# EasyEDA schematic SCH_Satlla_4_Main_Board_2023-01-26.json
TITLE: Main_Board_SATLLA_2.1; REV: 1.0; Date: 2021-02-11; Sheet: 1/1; Drawn By: KCG LAB; Company: KCG_LAB
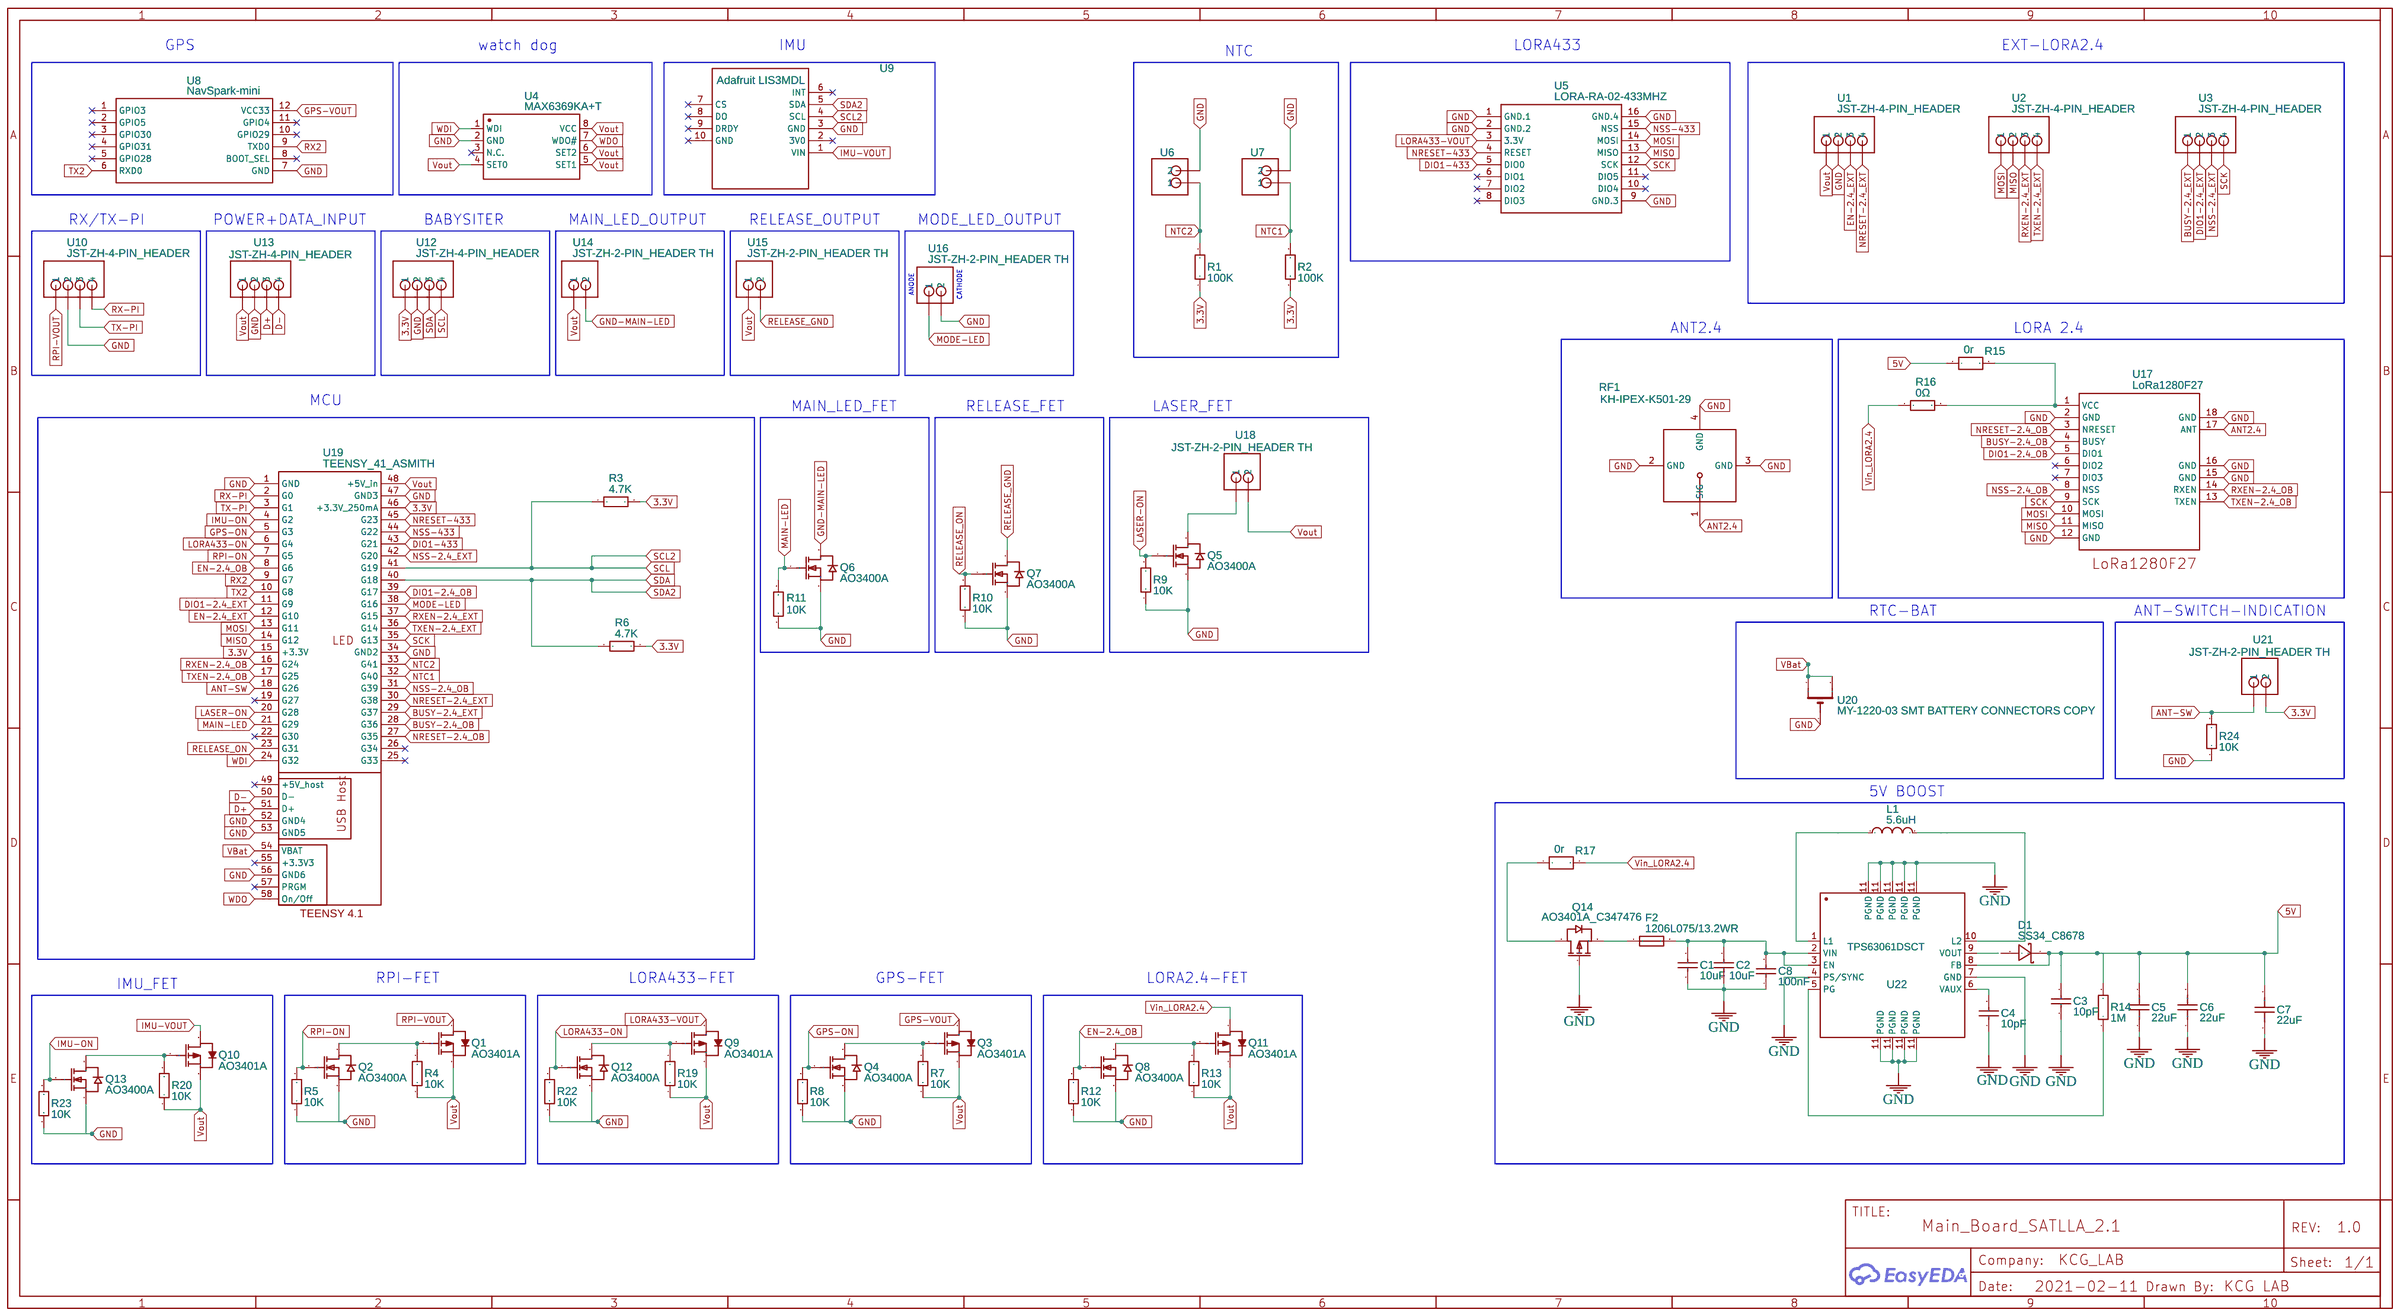
[diagram p0: schematic sheet]

## Parts
C1  10uF  [C0603]
C2  10uF  [C0603]
C3  10pF  [C0603]
C4  10pF  [C0603]
C5  22uF  [C0805]
C6  22uF  [C0805]
C7  22uF  [C0805]
C8  100nF  [C0603]
D1  SS34_C8678  [DO-214AC_L4.3-W2.7-LS5.3-RD]
F2  1206L075/13.2WR  [F1206]
L1  5.6uH  [IND-SMD_L5.4-W5.2]
Q1  AO3401A  [SOT-23_L2.9-W1.3-P1.90-LS2.4-BR]
Q2  AO3400A  [SOT-23-3_L2.9-W1.6-P1.90-LS2.8-BR]
Q3  AO3401A  [SOT-23_L2.9-W1.3-P1.90-LS2.4-BR]
Q4  AO3400A  [SOT-23-3_L2.9-W1.6-P1.90-LS2.8-BR]
Q5  AO3400A  [SOT-23-3_L2.9-W1.6-P1.90-LS2.8-BR]
Q6  AO3400A  [SOT-23-3_L2.9-W1.6-P1.90-LS2.8-BR]
Q7  AO3400A  [SOT-23-3_L2.9-W1.6-P1.90-LS2.8-BR]
Q8  AO3400A  [SOT-23-3_L2.9-W1.6-P1.90-LS2.8-BR]
Q9  AO3401A  [SOT-23_L2.9-W1.3-P1.90-LS2.4-BR]
Q10  AO3401A  [SOT-23_L2.9-W1.3-P1.90-LS2.4-BR]
Q11  AO3401A  [SOT-23_L2.9-W1.3-P1.90-LS2.4-BR]
Q12  AO3400A  [SOT-23-3_L2.9-W1.6-P1.90-LS2.8-BR]
Q13  AO3400A  [SOT-23-3_L2.9-W1.6-P1.90-LS2.8-BR]
Q14  AO3401A_C347476  [SOT-23_L2.9-W1.3-P1.90-LS2.4-BR]
R1  100K  [R0603]
R2  100K  [R0603]
R3  4.7K  [R0603]
R4  10K  [R0603]
R5  10K  [R0603]
R6  4.7K  [R0603]
R7  10K  [R0603]
R8  10K  [R0603]
R9  10K  [R0603]
R10  10K  [R0603]
R11  10K  [R0603]
R12  10K  [R0603]
R13  10K  [R0603]
R14  1M  [R0603]
R15  0r  [R0603]
R16  0Ω  [R0603]
R17  0r  [R0603]
R19  10K  [R0603]
R20  10K  [R0603]
R22  10K  [R0603]
R23  10K  [R0603]
R24  10K  [R0603]
RF1  KH-IPEX-K501-29  [ANT-SMD_KH-IPEX-K501-29]
U1  JST-ZH-4-PIN_HEADER  [JST-ZH-4 1.5MM]
U2  JST-ZH-4-PIN_HEADER  [JST-ZH-4 1.5MM]
U3  JST-ZH-4-PIN_HEADER  [JST-ZH-4 1.5MM]
U4  MAX6369KA+T  [SOT-23-8_L3.0-W1.7-P0.65-LS2.8-TL]
U5  LORA-RA-02-433MHZ  [LORA-RA2-SMD]
U6  JST-ZH-2-PIN_HEADER TH  [JST-ZH-2 1.5MM TH]
U7  JST-ZH-2-PIN_HEADER TH  [JST-ZH-2 1.5MM TH]
U8  NavSpark-mini  [NAVSPARK-MINI]
U9  Adafruit LIS3MDL  [9 DOF IMU_SATLLA_3]
U10  JST-ZH-4-PIN_HEADER  [JST-ZH-4 1.5MM]
U12  JST-ZH-4-PIN_HEADER  [JST-ZH-4 1.5MM]
U13  JST-ZH-4-PIN_HEADER  [JST-ZH-4 1.5MM]
U14  JST-ZH-2-PIN_HEADER TH  [JST-ZH-2 1.5MM TH]
U15  JST-ZH-2-PIN_HEADER TH  [JST-ZH-2 1.5MM TH]
U16  JST-ZH-2-PIN_HEADER TH  [JST-ZH-2 1.5MM TH]
U17  LoRa1280F27  [LORA1280F27]
U18  JST-ZH-2-PIN_HEADER TH  [JST-ZH-2 1.5MM TH]
U19  TEENSY_41_ASMITH  [TEENSY-4.1-ALL-PINS-ASMITH]
U20  MY-1220-03 SMT BATTERY CONNECTORS COPY  [MY-1220-03 SMT COPY]
U21  JST-ZH-2-PIN_HEADER TH  [JST-ZH-2 1.5MM TH]
U22  TPS63061DSCT  [WSON-10_L3.0-W3.0-P0.50-BL-EP]

## Library data of the parts
C1 C2 = GRM188R61C106MA73D: Supplier: LCSC; Manufacturer: MuRata; Contributor: LCSC; Supplier Part: C86277
C3 C4 = 0603CG100J101NT: Supplier: LCSC; Manufacturer: FH; Supplier Part: C56033; JLCPCB Part Class: Extended Part
C5-C7 = GRM219R61C226ME15L: Supplier: LCSC; Supplier Part: C162295; Manufacturer: Murata Electronics; Contributor: LCSC
C8 = 0603F104M500NT: Supplier: LCSC; Manufacturer: FH; Supplier Part: C42998; JLCPCB Part Class: Extended Part
D1 = SS34_C8678: Supplier: LCSC; Manufacturer Part: SS34; Manufacturer: MDD; Supplier Part: C8678; JLCPCB Part Class: Basic Part
F2 = 1206L075/13.2WR: Supplier: LCSC; Supplier Part: C207036; Manufacturer: Littelfuse; Contributor: LCSC
L1 = YSPI0530-5R6M: Supplier: LCSC; Supplier Part: C497860; Manufacturer: YJYCOIN; Contributor: LCSC
Q1 Q3 Q9-Q11 = AO3401A: Supplier: LCSC; Manufacturer: AOS; Supplier Part: C15127; JLCPCB Part Class: Basic Part; Package Display: No
Q2 Q4-Q8 Q12 Q13 = AO3400A: Supplier: LCSC; Manufacturer: AOS; image: //image.lceda.cn/szlcsc/C20917.jpg; Supplier Part: C20917; SMT Type: Basic; JLCPCB SMD: Yes; LCSC Assembly: Yes
Q14 = AO3401A_C347476: Supplier: LCSC; Supplier Part: C347476; Manufacturer: Youtai Semiconductor Co., Ltd.; Manufacturer Part: AO3401A; Contributor: LCSC; JLCPCB Part Class: Extended Part
R1 R2 = RC0603JR-07100KL: Supplier: LCSC; Supplier Part: C100048; Manufacturer: YAGEO; Contributor: LCSC; JLCPCB Part Class: Extended Part
R3 R6 = RMC06034.7K1%N: Supplier: LCSC; Supplier Part: C269713; Manufacturer: Tyohm; Contributor: LCSC; JLCPCB Part Class: Extended Part
R4 R5 R7-R13 R19 R20 R22-R24 = 0603WAF1002T5E: Supplier: LCSC; Manufacturer: UniOhm; Supplier Part: C25804; SMT Type: Basic; JLCPCB SMD: Yes; LCSC Assembly: Yes
R14 = ERJ3GEYJ105V: Supplier: LCSC; Supplier Part: C278634; Manufacturer: PANASONIC; Contributor: LCSC
R15 R17 = R_0603_EU: Contributor: LCEDA_Lib
R16 = 0603WAF0000T5E: Supplier: LCSC; Manufacturer: UniOhm; Supplier Part: C21189; Resistance (Ohms): 0; JLCPCB Part Class: Basic Part
RF1 = KH-IPEX-K501-29: Supplier: LCSC; Supplier Part: C411563; Manufacturer: Shenzhen Kinghelm Elec; Contributor: LCSC; JLCPCB Part Class: Extended Part
U1-U3 U10 U12 U13 = JST-ZH-4-PIN_HEADER
U4 = MAX6369KA+T: Supplier: LCSC; Manufacturer: MAXIM; Supplier Part: C128613; JLCPCB Part Class: Extended Part
U5 = LORA-RA-02-433MHZ: 433 MHz Lora Ra-02 Radio Transceiver Module based on SX1276 chip.; Contributor: איגור אוצ\'נסקי
U6 U7 U14-U16 U18 U21 = JST-ZH-2-PIN_HEADER TH: Contributor: Herve Goncalves
U8 = NavSpark-mini: Contributor: tpallay; Package Display: No
U9 = Adafruit LIS3MDL: Manufacturer: Adafruit; Supplier: Mouser; Supplier Part: 485-4479; link: https://learn.adafruit.com/lis3mdl-triple-axis-magnetometer; Contributor: ABDC
U17 = LoRa1280F27: link: https://www.nicerf.com/product_146_301.html; Contributor: jyesmith
U19 = TEENSY_41_ASMITH: Contributor: diaphone
U20 = MY-1220-03 SMT BATTERY CONNECTORS COPY: link: https://datasheet.lcsc.com/lcsc/2012181809_MYOUNG-MY-1220-03_C964818.pdf; Contributor: igselyanko; Package Display: No
U22 = TPS63061DSCT: Supplier: LCSC; Manufacturer: TI; Supplier Part: C134127; LCSC Assembly: Yes; SMT Type: Extend

## Nets
3.3V: R1.1 R2.1 R3.2 R6.2 U12.P1(1) U19.15(+3.3V) U19.46(+3.3V_250mA) U21.2
5V: C3.2 C5.2 C6.2 C7.2 D1.1(K) R14.2 R15.1 U22.8(FB)
GND: C1.1 C2.1 C3.1 C4.1 C5.1 C6.1 C7.1 C8.1 Q2.2(S) Q4.2(S) Q5.2(S) Q6.2(S) Q7.2(S) Q8.2(S) Q12.2(S) Q13.2(S) Q14.1(G) R5.1 R8.1 R9.1 R10.1 R11.1 R12.1 R22.1 R23.1 R24.1 RF1.2(GND) RF1.3(GND) RF1.4(GND) U1.P2(2) U4.2(GND) U5.1(GND.1) U5.2(GND.2) U5.9(GND.3) U5.16(GND.4) U6.2 U7.2 U8.7(GND) U9.3(GND) U10.P2(2) U12.P2(2) U13.P2(2) U16.2 U17.2(GND) U17.12(GND) U17.15(GND) U17.16(GND) U17.18(GND) U19.1(GND) U19.34(GND2) U19.47(GND3) U19.52(GND4) U19.53(GND5) U19.56(GND6) U20.4(-) U22.4(PS/SYNC) U22.7(GND) U22.11(PGND)
GND-MAIN-LED: Q6.3(D) U14.2
VBat: U19.54(VBAT) U20.1(+) U20.2(+)
Vin_LORA2.4: Q11.3(D) R16.1 R17.2
ANT2.4: RF1.1(SIG) U17.17(ANT)
ANT-SW: R24.2 U19.18(G26) U21.1
BUSY-2.4_EXT: U3.P1(1) U19.29(G37)
BUSY-2.4_OB: U17.4(BUSY) U19.28(G36)
D+: U13.P3(3) U19.51(D+)
D-: U13.P4(4) U19.50(D-)
DIO1-2.4_EXT: U3.P2(2) U19.11(G9)
DIO1-2.4_OB: U17.5(DIO1) U19.39(G17)
DIO1-433: U5.5(DIO0) U19.43(G21)
EN-2.4_EXT: U1.P3(3) U19.12(G10)
EN-2.4_OB: Q8.1(G) R12.2 U19.8(G6)
GPS-ON: Q4.1(G) R8.2 U19.5(G3)
GPS-VOUT: Q3.3(D) U8.12(VCC33)
IMU-ON: Q13.1(G) R23.2 U19.4(G2)
IMU-VOUT: Q10.3(D) U9.1(VIN)
LASER-ON: Q5.1(G) R9.2 U19.20(G28)
LORA433-ON: Q12.1(G) R22.2 U19.6(G4)
LORA433-VOUT: Q9.3(D) U5.3(3.3V)
MAIN-LED: Q6.1(G) R11.2 U19.21(G29)
MISO: U2.P2(2) U5.13(MISO) U17.11(MISO) U19.14(G12)
MODE-LED: U16.1 U19.38(G16)
MOSI: U2.P1(1) U5.14(MOSI) U17.10(MOSI) U19.13(G11)
NRESET-2.4_EXT: U1.P4(4) U19.30(G38)
NRESET-2.4_OB: U17.3(NRESET) U19.27(G35)
NRESET-433: U5.4(RESET) U19.45(G23)
NSS-2.4_EXT: U3.P3(3) U19.42(G20)
NSS-2.4_OB: U17.8(NSS) U19.31(G39)
NSS-433: U5.15(NSS) U19.44(G22)
NTC1: R2.2 U7.1 U19.32(G40)
NTC2: R1.2 U6.1 U19.33(G41)
RELEASE_GND: Q7.3(D) U15.2
RELEASE_ON: Q7.1(G) R10.2 U19.23(G31)
RPI-ON: Q2.1(G) R5.2 U19.7(G5)
RPI-VOUT: Q1.3(D) U10.P1(1)
RX2: U8.9(TXD0) U19.9(G7)
RX-PI: U10.P4(4) U19.2(G0)
RXEN-2.4_EXT: U2.P3(3) U19.37(G15)
RXEN-2.4_OB: U17.14(RXEN) U19.16(G24)
SCK: U3.P4(4) U5.12(SCK) U17.9(SCK) U19.35(G13)
SCL: R3.1 U9.4(SCL) U12.P4(4) U19.41(G19)
SDA: R6.1 U9.5(SDA) U12.P3(3) U19.40(G18)
TX2: U8.6(RXD0) U19.10(G8)
TX-PI: U10.P3(3) U19.3(G1)
TXEN-2.4_EXT: U2.P4(4) U19.36(G14)
TXEN-2.4_OB: U17.13(TXEN) U19.17(G25)
Vout: Q1.2(S) Q3.2(S) Q9.2(S) Q10.2(S) Q11.2(S) R4.1 R7.1 R13.1 R19.1 R20.1 U1.P1(1) U4.4(SET0) U4.5(SET1) U4.6(SET2) U4.8(VCC) U13.P1(1) U14.1 U15.1 U18.2 U19.48(+5V in)
WDI: U4.1(WDI) U19.24(G32)
WDO: U4.7(WDO#) U19.58(On/Off)
Net-(C1-2): C1.2 C2.2 C8.2 F2.2 U22.2(VIN) U22.3(EN)
Net-(C4-2): C4.2 U22.6(VAUX)
Net-(F2-1): F2.1 Q14.2(S)
Net-(L1-1): L1.1 U22.1(L1)
Net-(L1-2): L1.2 U22.10(L2)
Net-(Q1-1): Q1.1(G) Q2.3(D) R4.2
Net-(Q3-1): Q3.1(G) Q4.3(D) R7.2
Net-(Q5-3): Q5.3(D) U18.1
Net-(Q8-3): Q8.3(D) Q11.1(G) R13.2
Net-(Q9-1): Q9.1(G) Q12.3(D) R19.2
Net-(Q10-1): Q10.1(G) Q13.3(D) R20.2
Net-(Q14-3): Q14.3(D) R17.1
Net-(R14-1): R14.1 U22.5(PG)
Net-(R15-2): R15.2 R16.2 U17.1(VCC)

Not connected (* = marked no-connect by the designer): D1 2(A); U4 3(N.C.)*; U5 6(DIO1)* 7(DIO2)* 8(DIO3)* 10(DIO4)* 11(DIO5)*; U8 1(GPIO3)* 2(GPIO5)* 3(GPIO30)* 4(GPIO31)* 5(GPIO28)* 8(BOOT_SEL)* 10(GPIO29)* 11(GPIO4)*; U9 2(3V0)* 6(INT)* 7(CS)* 8(DO)* 9(DRDY)* 10(GND)*; U17 6(DIO2)* 7(DIO3)*; U19 19(G27)* 22(G30)* 25(G33)* 26(G34)* 49(+5V host)* 55(+3.3V3)* 57(PRGM)*; U22 9(VOUT)

## Notes on the sheet
- GPS
- watch dog
- IMU
- LORA433
- EXT-LORA2.4
- NTC
- RX/TX-PI
- POWER+DATA_INPUT
- BABYSITER
- MAIN_LED_OUTPUT
- RELEASE_OUTPUT
- MODE_LED_OUTPUT
- ANODE
- CATHODE
- ANT2.4
- LORA 2.4
- MCU
- MAIN_LED_FET
- RELEASE_FET
- LASER_FET
- RTC-BAT
- ANT-SWITCH-INDICATION
- 5V BOOST
- IMU_FET
- RPI-FET
- LORA433-FET
- GPS-FET
- LORA2.4-FET
